# Altium schematic sheet SheetPowerMesh.SchDoc
size A; DocumentNumber: 2; SheetNumber: 2; SheetTotal: 5
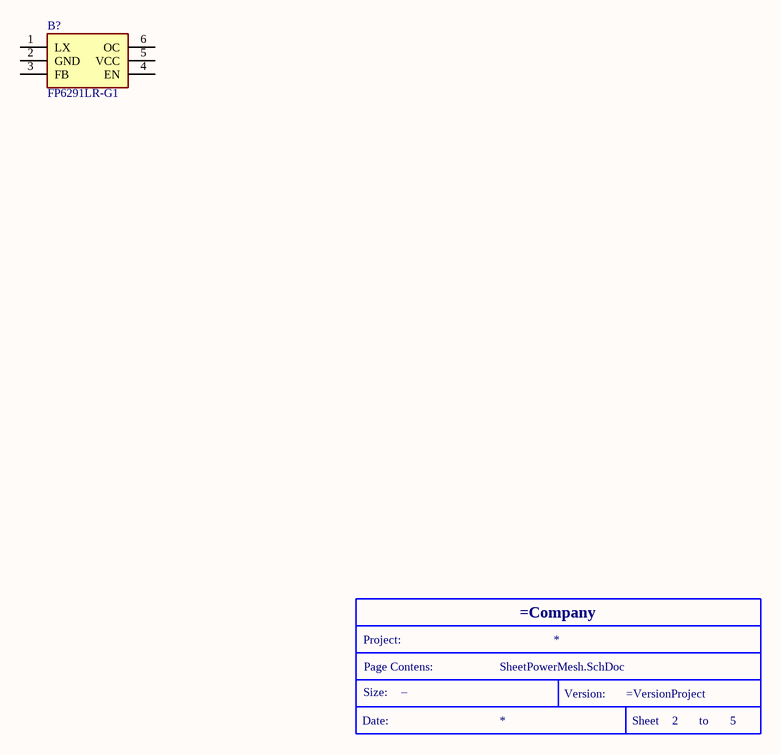
[diagram p0: SheetPowerMesh.SchDoc]

## Parts
*  SizePage: _  (hidden comment: TitleBlock)  (graphical)
B?  FP6291LR-G1  [SOT95P280X145-6N]

## Nets

Not connected (* = marked no-connect by the designer): B? 1(LX) 2(GND) 3(FB) 4(EN) 5(VCC) 6(OC)

## Notes on the sheet
- (in symbol TitleBlock) Project:; Page Contens:; Size:; Version:; Date:; Sheet; to

## Library data of the parts
B? = FP6291LR-G1: 2A 5.5V SOT-23-6 DC-DC Converters ROHS; Manufacturer_Name: Feeling Technology; Geometry.Height: 1.45mm; Manufacturer_Part_Number: FP6291LR-G1; Mouser Part Number: *; Mouser Price/Stock: *; Arrow Part Number: *; Arrow Price/Stock: *; Datasheet Link: https://datasheet.lcsc.com/lcsc/1810182113_Feeling-Tech-FP6291LR-G1_C18701.pdf